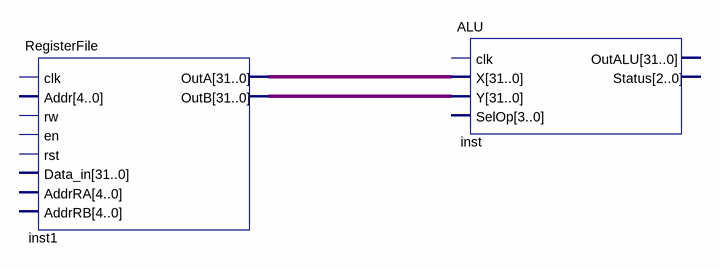
[diagram p0: schematic sheet]
// Quartus schematic sim.bdf as structural Verilog: 2 symbols, 0 pins
module sim (
);

  wire [31:0] inst1_outa, inst1_outb;

  RegisterFile inst1 (.OutA(inst1_outa), .OutB(inst1_outb));  // open: clk, Addr, rw, en, rst, Data_in, AddrRA, AddrRB
  ALU inst (.X(inst1_outa), .Y(inst1_outb));  // open: clk, SelOp, OutALU, Status
endmodule
